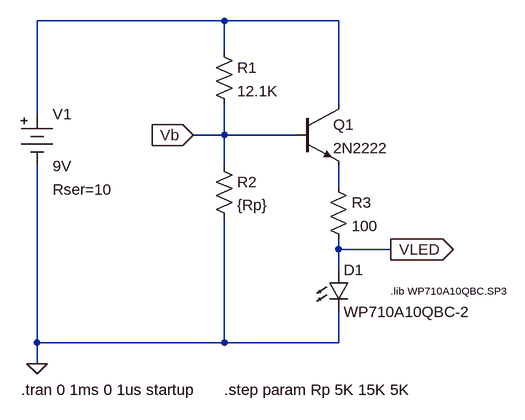
[diagram p0: schematic Photosensor.asc]
Photosensor.asc, the LTspice schematic file:
Version 4
SHEET 1 936 680
WIRE 144 -48 -144 -48
WIRE 320 -48 144 -48
WIRE 144 0 144 -48
WIRE 320 80 320 -48
WIRE -144 96 -144 -48
WIRE 144 128 144 80
WIRE 144 128 96 128
WIRE 256 128 144 128
WIRE 144 176 144 128
WIRE 320 208 320 176
WIRE 320 304 320 288
WIRE 400 304 320 304
WIRE 320 336 320 304
WIRE -144 448 -144 176
WIRE 144 448 144 256
WIRE 144 448 -144 448
WIRE 320 448 320 400
WIRE 320 448 144 448
WIRE -144 480 -144 448
FLAG -144 480 0
FLAG 400 304 VLED
IOPIN 400 304 Out
FLAG 96 128 Vb
IOPIN 96 128 In
SYMBOL res 128 -16 R0
SYMATTR InstName R1
SYMATTR Value 12.1K
SYMATTR SpiceLine tol=1 pwr=0.1
SYMBOL res 128 160 R0
SYMATTR InstName R2
SYMATTR Value {Rp}
SYMATTR SpiceLine tol=1 pwr=0.1
SYMBOL res 304 192 R0
SYMATTR InstName R3
SYMATTR Value 100
SYMATTR SpiceLine tol=1 pwr=0.1
SYMBOL npn 256 80 R0
SYMATTR InstName Q1
SYMATTR Value 2N2222
SYMBOL LED 304 336 R0
SYMATTR InstName D1
SYMATTR Value WP710A10QBC-2
SYMBOL Misc\\battery -144 80 R0
WINDOW 123 0 0 Left 0
WINDOW 39 24 132 Left 2
SYMATTR SpiceLine Rser=10
SYMATTR InstName V1
SYMATTR Value 9V
TEXT -168 520 Left 2 !.tran 0 1ms 0 1us startup
TEXT 144 520 Left 2 !.step param Rp 5K 15K 5K
TEXT 400 368 Left 1 !.lib WP710A10QBC.SP3

The netlist it stands for:
* Photosensor.asc
R1 N001 Vb 12.1K tol=1 pwr=0.1
R2 Vb 0 {Rp} tol=1 pwr=0.1
R3 N002 VLED 100 tol=1 pwr=0.1
Q1 N001 Vb N002 0 2N2222
D1 VLED 0 WP710A10QBC-2
V1 N001 0 9V Rser=10
.model D D
.lib standard.dio
.model NPN NPN
.model PNP PNP
.lib standard.bjt
.tran 0 1ms 0 1us startup
.step param Rp 5K 15K 5K
.lib WP710A10QBC.SP3
.backanno
.end

* Results of the author's LTspice run, read from the files saved beside the schematic
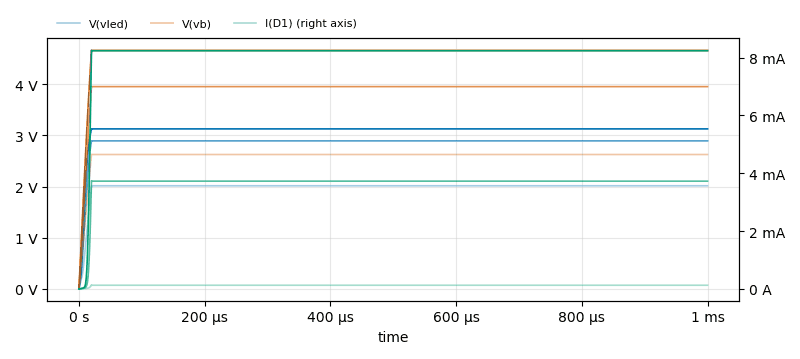
[diagram p1: Transient Analysis of Photosensor.asc, plotted from the saved traces]
* Transient Analysis, 3 runs:
*   V(vled) [rp=5000]: min 0 V, max 2.017 V, average 1.993 V, rms 2.001 V, last 2.016 V
*   V(vled) [rp=10000]: min 0 V, max 2.895 V, average 2.865 V, rms 2.876 V, last 2.895 V
*   V(vled) [rp=15000]: min 0 V, max 3.129 V, average 3.101 V, rms 3.111 V, last 3.129 V
*   V(vb) [rp=5000]: min 0 V, max 2.63 V, average 2.601 V, rms 2.61 V, last 2.628 V
*   V(vb) [rp=10000]: min 0 V, max 3.958 V, average 3.917 V, rms 3.93 V, last 3.956 V
*   V(vb) [rp=15000]: min 0 V, max 4.666 V, average 4.619 V, rms 4.634 V, last 4.664 V
*   I(D1) [rp=5000]: min 0 A, max 138.9 µA, average 121 µA, rms 121.9 µA, last 123 µA
*   I(D1) [rp=10000]: min 0 A, max 3.741 mA, average 3.661 mA, rms 3.691 mA, last 3.725 mA
*   I(D1) [rp=15000]: min 0 A, max 8.251 mA, average 8.104 mA, rms 8.165 mA, last 8.238 mA